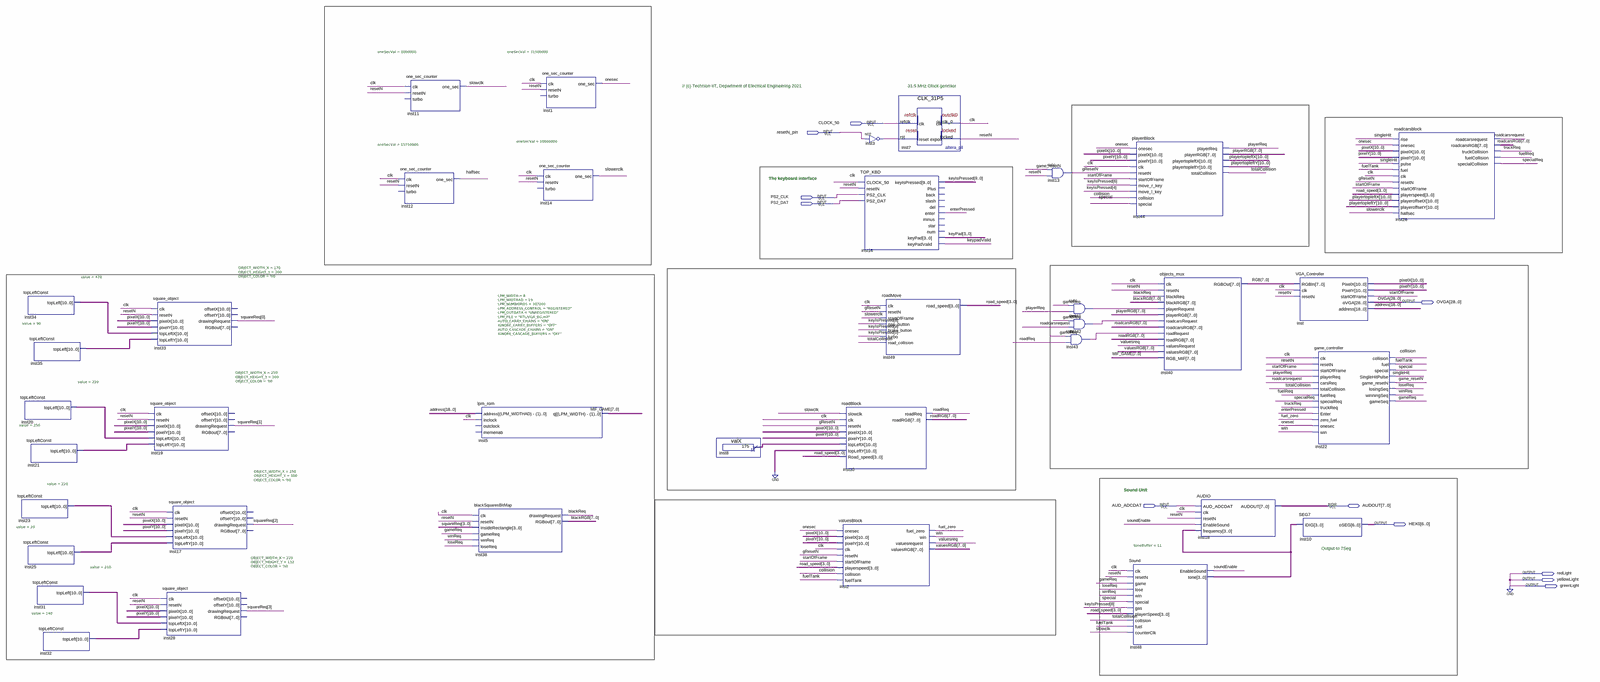
[diagram p0: schematic sheet, whole]
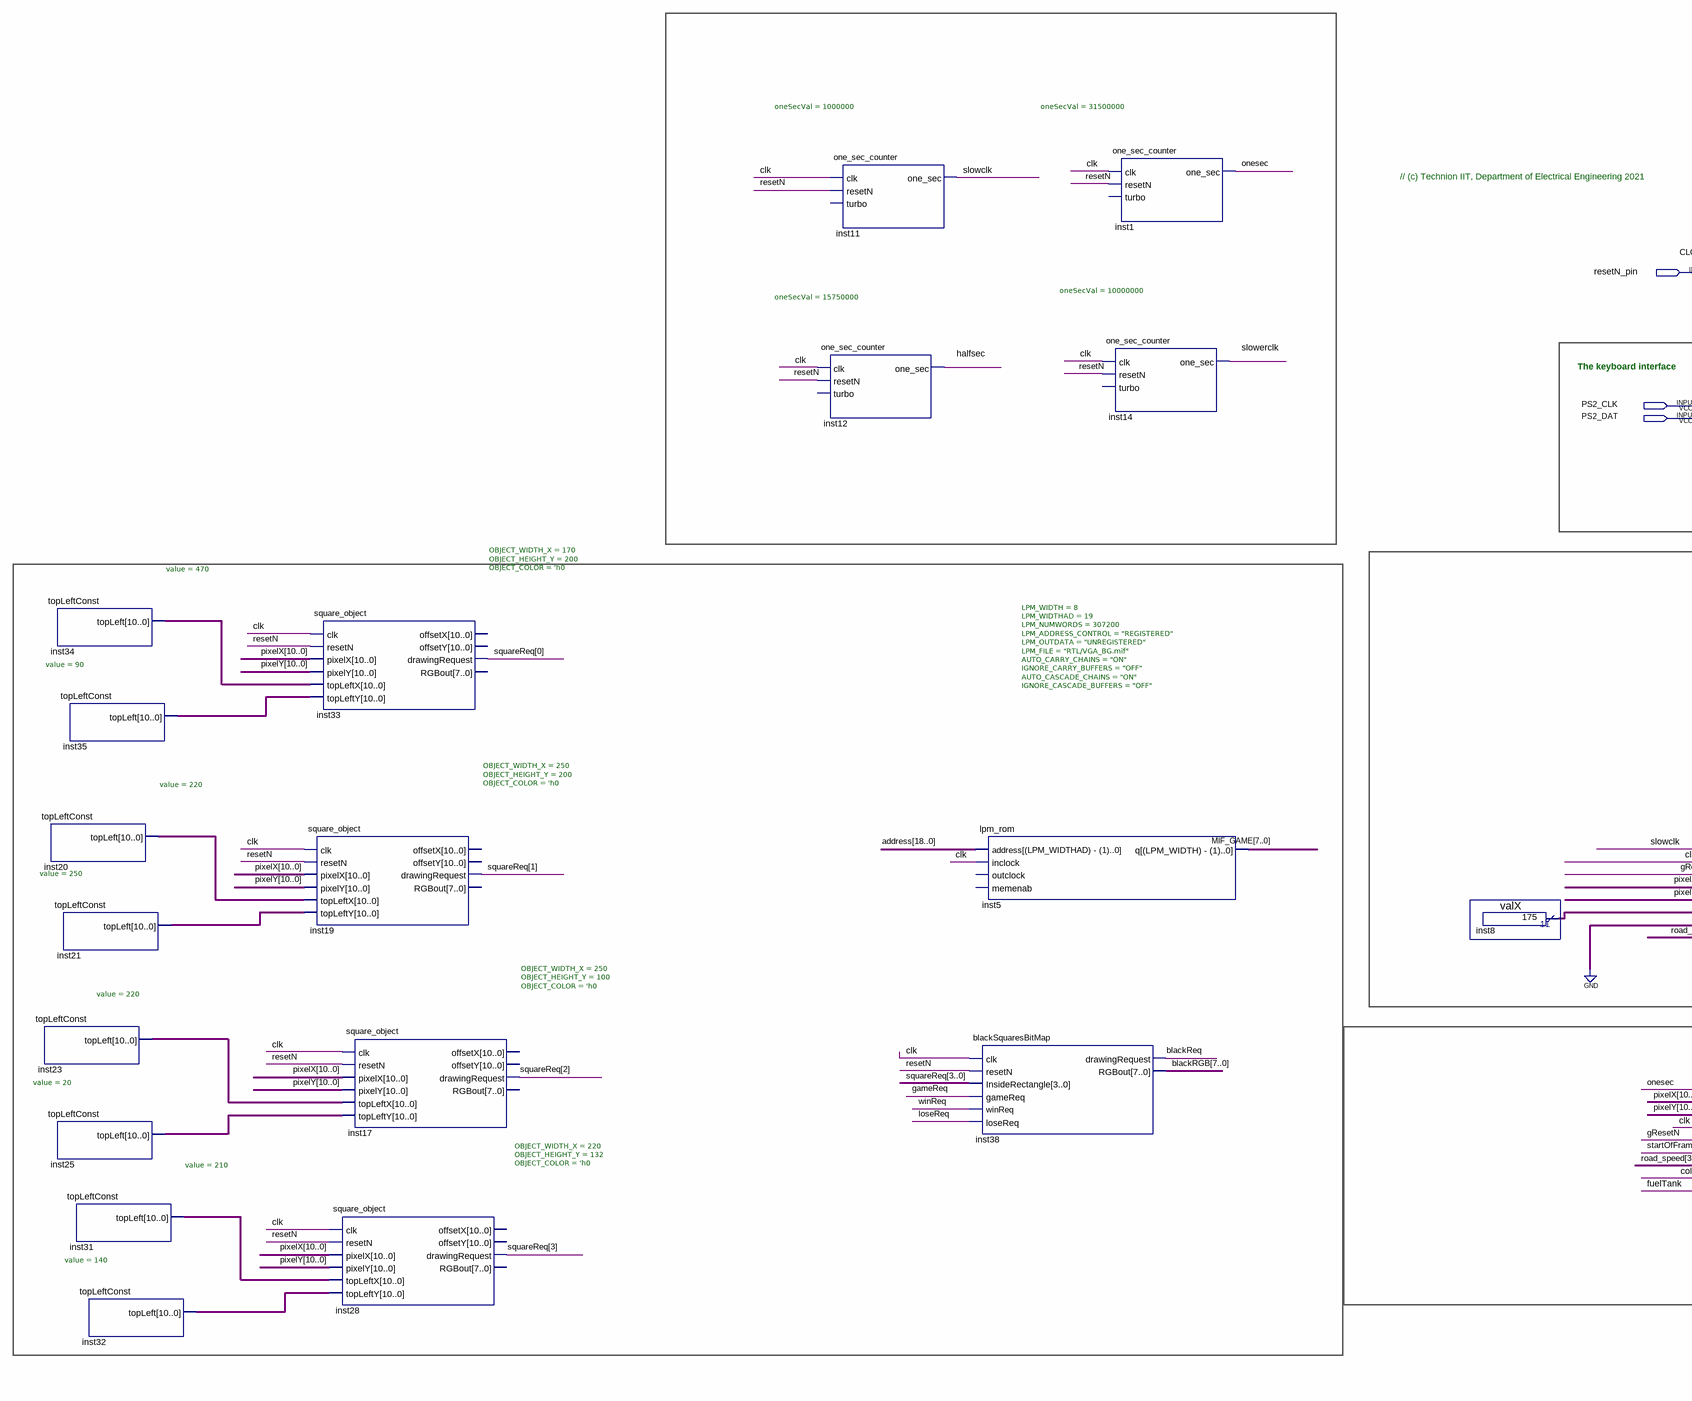
[diagram p1: schematic sheet, left part]
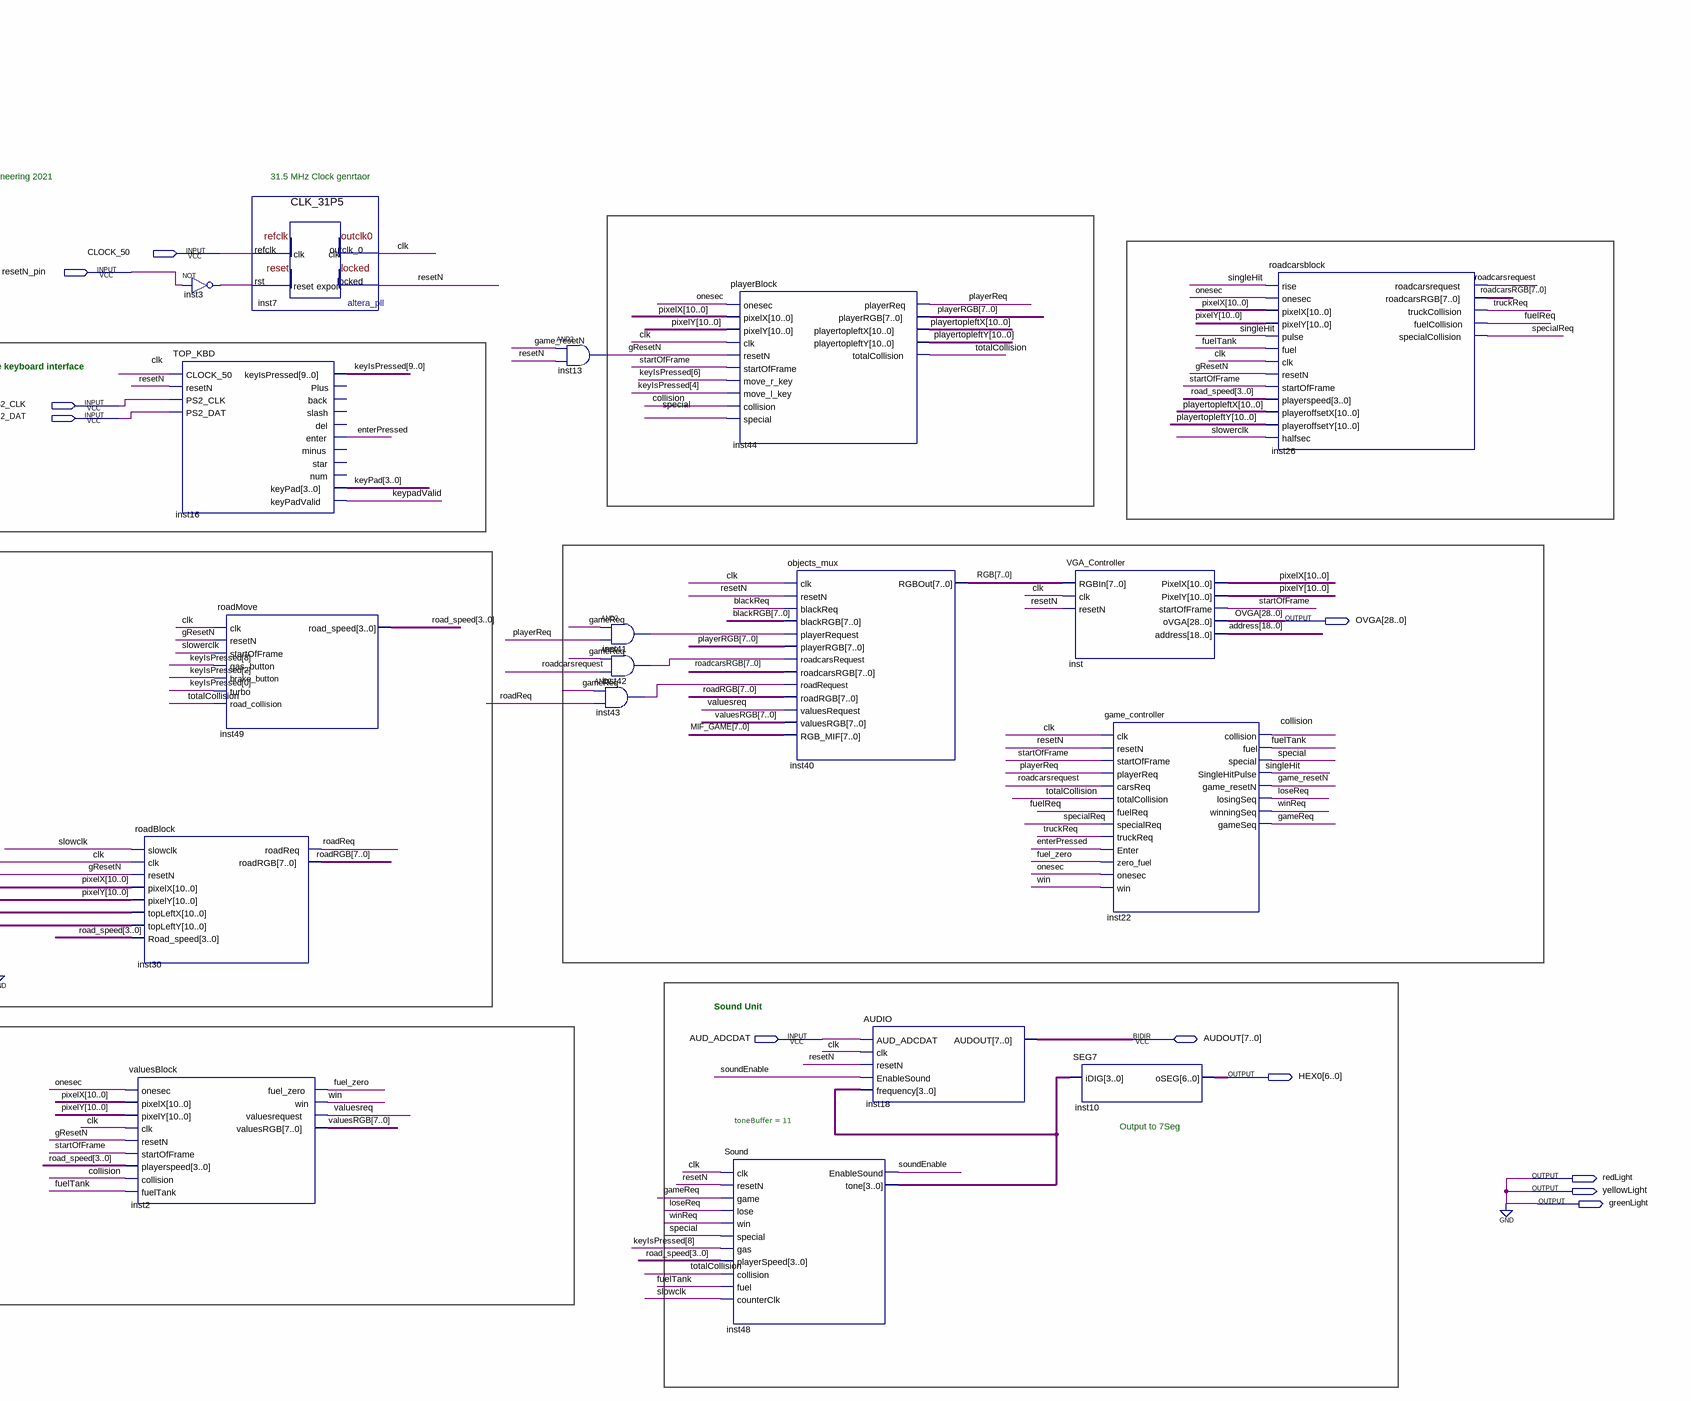
[diagram p2: schematic sheet, right part]
// Quartus schematic TOP_VGA.bdf as structural Verilog: 37 symbols, 11 pins
module TOP_VGA (
  input  CLOCK_50,
  input  resetN_pin,
  input  PS2_CLK,
  input  PS2_DAT,
  input  AUD_ADCDAT,
  inout  [7:0] AUDOUT,
  output [28:0] OVGA,
  output [6:0] HEX0,
  output redLight,
  output yellowLight,
  output greenLight
);

  wire blackReq, clk, collision, enterPressed, fuel_zero, fuelReq, fuelTank, game_resetN, gameReq, gResetN,
       halfsec, inst3_out, inst41_out, inst42_out, inst43_out, keypadValid, loseReq, onesec, playerReq,
       resetN, roadcarsrequest, roadReq, singleHit, slowclk, slowerclk, soundEnable, special, specialReq,
       startOfFrame, totalCollision, truckReq, valuesreq, win, winReq;
  wire [3:0] inst48_tone, keyPad, road_speed, squareReq;
  wire [7:0] blackRGB, MIF_GAME, playerRGB, RGB, roadcarsRGB, roadRGB, valuesRGB;
  wire [9:0] keyIsPressed;
  wire [10:0] inst8_result, inst20_topleft, inst21_topleft, inst23_topleft, inst25_topleft, inst31_topleft,
       inst32_topleft, inst34_topleft, inst35_topleft, pixelX, pixelY, playertopleftX, playertopleftY;
  wire [18:0] address;

  topLeftConst #(.value(470)) inst34 (.topLeft(inst34_topleft));
  topLeftConst #(.value(90)) inst35 (.topLeft(inst35_topleft));
  topLeftConst #(.value(220)) inst20 (.topLeft(inst20_topleft));
  topLeftConst #(.value(250)) inst21 (.topLeft(inst21_topleft));
  topLeftConst #(.value(220)) inst23 (.topLeft(inst23_topleft));
  topLeftConst #(.value(20)) inst25 (.topLeft(inst25_topleft));
  topLeftConst #(.value(210)) inst31 (.topLeft(inst31_topleft));
  topLeftConst #(.value(140)) inst32 (.topLeft(inst32_topleft));
  square_object #(.OBJECT_WIDTH_X(170), .OBJECT_HEIGHT_Y(200), .OBJECT_COLOR('h0)) inst33 (
    .clk(clk), .resetN(resetN), .pixelX(pixelX), .pixelY(pixelY), .topLeftX(inst34_topleft),
    .topLeftY(inst35_topleft), .drawingRequest(squareReq[0]));  // open: offsetX, offsetY, RGBout
  square_object #(.OBJECT_WIDTH_X(250), .OBJECT_HEIGHT_Y(200), .OBJECT_COLOR('h0)) inst19 (
    .clk(clk), .resetN(resetN), .pixelX(pixelX), .pixelY(pixelY), .topLeftX(inst20_topleft),
    .topLeftY(inst21_topleft), .drawingRequest(squareReq[1]));  // open: offsetX, offsetY, RGBout
  square_object #(.OBJECT_WIDTH_X(250), .OBJECT_HEIGHT_Y(100), .OBJECT_COLOR('h0)) inst17 (
    .clk(clk), .resetN(resetN), .pixelX(pixelX), .pixelY(pixelY), .topLeftX(inst23_topleft),
    .topLeftY(inst25_topleft), .drawingRequest(squareReq[2]));  // open: offsetX, offsetY, RGBout
  square_object #(.OBJECT_WIDTH_X(220), .OBJECT_HEIGHT_Y(132), .OBJECT_COLOR('h0)) inst28 (
    .clk(clk), .resetN(resetN), .pixelX(pixelX), .pixelY(pixelY), .topLeftX(inst31_topleft),
    .topLeftY(inst32_topleft), .drawingRequest(squareReq[3]));  // open: offsetX, offsetY, RGBout
  one_sec_counter #(.oneSecVal(1000000)) inst11 (.clk(clk), .resetN(resetN), .one_sec(slowclk));  // open: turbo
  one_sec_counter #(.oneSecVal(15750000)) inst12 (.clk(clk), .resetN(resetN), .one_sec(halfsec));  // open: turbo
  lpm_rom #(.LPM_WIDTH(8), .LPM_WIDTHAD(19), .LPM_NUMWORDS(307200), .LPM_ADDRESS_CONTROL("REGISTERED"), .LPM_OUTDATA("UNREGISTERED"), .LPM_FILE("RTL/VGA_BG.mif"), .AUTO_CARRY_CHAINS("ON"), .IGNORE_CARRY_BUFFERS("OFF"), .AUTO_CASCADE_CHAINS("ON"), .IGNORE_CASCADE_BUFFERS("OFF")) inst5 (
    .address(address), .inclock(clk), .q(MIF_GAME));  // open: outclock, memenab
  blackSquaresBitMap inst38 (
    .clk(clk), .resetN(resetN), .InsideRectangle(squareReq), .gameReq(gameReq), .winReq(winReq),
    .loseReq(loseReq), .drawingRequest(blackReq), .RGBout(blackRGB));
  one_sec_counter #(.oneSecVal(31500000)) inst1 (.clk(clk), .resetN(resetN), .one_sec(onesec));  // open: turbo
  one_sec_counter #(.oneSecVal(10000000)) inst14 (.clk(clk), .resetN(resetN), .one_sec(slowerclk));  // open: turbo
  valX inst8 (.result(inst8_result));
  roadBlock inst30 (
    .slowclk(slowclk), .clk(clk), .resetN(gResetN), .pixelX(pixelX), .pixelY(pixelY),
    .topLeftX(inst8_result), .topLeftY({11{1'b0}}), .Road_speed(road_speed), .roadReq(roadReq),
    .roadRGB(roadRGB));
  valuesBlock inst2 (
    .onesec(onesec), .pixelX(pixelX), .pixelY(pixelY), .clk(clk), .resetN(gResetN),
    .startOfFrame(startOfFrame), .playerspeed(road_speed), .collision(collision), .fuelTank(fuelTank),
    .fuel_zero(fuel_zero), .win(win), .valuesrequest(valuesreq), .valuesRGB(valuesRGB));
  not inst3 (inst3_out, resetN_pin);
  TOP_KBD inst16 (
    .CLOCK_50(clk), .resetN(resetN), .PS2_CLK(PS2_CLK), .PS2_DAT(PS2_DAT), .keyIsPressed(keyIsPressed),
    .enter(enterPressed), .keyPad(keyPad), .keyPadValid(keypadValid));  // open: Plus, back, slash, del, minus, star, num
  CLK_31P5 inst7 (.refclk(CLOCK_50), .rst(inst3_out), .outclk_0(clk), .locked(resetN));
  roadMove inst49 (
    .clk(clk), .resetN(gResetN), .startOfFrame(slowerclk), .gas_button(keyIsPressed[8]),
    .brake_button(keyIsPressed[2]), .turbo(keyIsPressed[0]), .road_collision(totalCollision),
    .road_speed(road_speed));
  and inst13 (gResetN, game_resetN, resetN);
  and inst41 (inst41_out, gameReq, playerReq);
  and inst42 (inst42_out, gameReq, roadcarsrequest);
  and inst43 (inst43_out, gameReq, roadReq);
  playerBlock inst44 (
    .onesec(onesec), .pixelX(pixelX), .pixelY(pixelY), .clk(clk), .resetN(gResetN),
    .startOfFrame(startOfFrame), .move_r_key(keyIsPressed[6]), .move_l_key(keyIsPressed[4]),
    .collision(collision), .special(special), .playerReq(playerReq), .playerRGB(playerRGB),
    .playertopleftX(playertopleftX), .playertopleftY(playertopleftY), .totalCollision(totalCollision));
  Sound #(.toneBuffer(11)) inst48 (
    .clk(clk), .resetN(resetN), .game(gameReq), .lose(loseReq), .win(winReq), .special(special),
    .gas(keyIsPressed[8]), .playerSpeed(road_speed), .collision(totalCollision), .fuel(fuelTank),
    .counterClk(slowclk), .EnableSound(soundEnable), .tone(inst48_tone));
  objects_mux inst40 (
    .clk(clk), .resetN(resetN), .blackReq(blackReq), .blackRGB(blackRGB), .playerRequest(inst41_out),
    .playerRGB(playerRGB), .roadcarsRequest(inst42_out), .roadcarsRGB(roadcarsRGB), .roadRequest(inst43_out),
    .roadRGB(roadRGB), .valuesRequest(valuesreq), .valuesRGB(valuesRGB), .RGB_MIF(MIF_GAME), .RGBOut(RGB));
  AUDIO inst18 (
    .AUD_ADCDAT(AUD_ADCDAT), .clk(clk), .resetN(resetN), .EnableSound(soundEnable), .frequency(inst48_tone),
    .AUDOUT(AUDOUT));
  VGA_Controller inst (
    .RGBIn(RGB), .clk(clk), .resetN(resetN), .PixelX(pixelX), .PixelY(pixelY), .startOfFrame(startOfFrame),
    .oVGA(OVGA), .address(address));
  game_controller inst22 (
    .clk(clk), .resetN(resetN), .startOfFrame(startOfFrame), .playerReq(playerReq),
    .carsReq(roadcarsrequest), .totalCollision(totalCollision), .fuelReq(fuelReq), .specialReq(specialReq),
    .truckReq(truckReq), .Enter(enterPressed), .zero_fuel(fuel_zero), .onesec(onesec), .win(win),
    .collision(collision), .fuel(fuelTank), .special(special), .SingleHitPulse(singleHit),
    .game_resetN(game_resetN), .losingSeq(loseReq), .winningSeq(winReq), .gameSeq(gameReq));
  SEG7 inst10 (.iDIG(inst48_tone), .oSEG(HEX0));
  roadcarsblock inst26 (
    .rise(singleHit), .onesec(onesec), .pixelX(pixelX), .pixelY(pixelY), .pulse(singleHit), .fuel(fuelTank),
    .clk(clk), .resetN(gResetN), .startOfFrame(startOfFrame), .playerspeed(road_speed),
    .playeroffsetX(playertopleftX), .playeroffsetY(playertopleftY), .halfsec(slowerclk),
    .roadcarsrequest(roadcarsrequest), .roadcarsRGB(roadcarsRGB), .truckCollision(truckReq),
    .fuelCollision(fuelReq), .specialCollision(specialReq));

  assign greenLight = 1'b0;
  assign redLight = 1'b0;
  assign yellowLight = 1'b0;

  // Notes on the sheet:
  //   // (c) Technion IIT, Department of Electrical Engineering 2021
  //   31.5 MHz Clock genrtaor
  //   The keyboard interface
  //   Sound Unit
  //   Output to 7Seg
endmodule
